# Altium schematic sheet BigButtons.SchDoc
size Letter; Organization: Ploopy Corporation; Address1: 137-1140 Burnhamthorpe Road W; Address3: Ontario; DocumentNumber: 2; Revision: R1.007; SheetNumber: 2; SheetTotal: 5
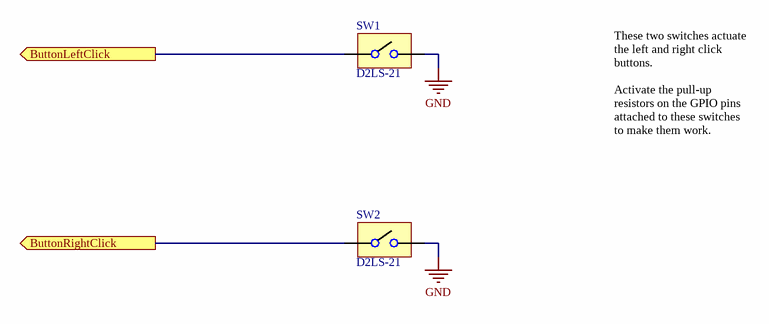
[diagram p0: BigButtons.SchDoc]

## Parts
SW1  D2LS-21  [D2LS-21]
SW2  D2LS-21  [D2LS-21]

## Ports
ButtonLeftClick (out), ButtonRightClick (out)

## Nets
GND: SW1.B SW2.B
ButtonLeftClick: SW1.A ; port ButtonLeftClick
ButtonRightClick: SW2.A ; port ButtonRightClick

## Notes on the sheet
- These two switches actuate the left and right click buttons.
  Activate the pull-up resistors on the GPIO pins attached to these switches to make them work.
- Copyright Ploopy Corporation 2024
- Licensed under the CERN-OHL-S v2
- http://ohwr.org/cernohl
- Title:
- PCB:
- Version:
- Ploopy Corporation
- Mississauga ON L5C 0A3
- 137-1140 Burnhamthorpe Road W
- Date:
- Time:
- Sheet
- of
- Canada

## Library data of the parts
SW1 SW2 = D2LS-21: Compact Surface-mounting Switch for long durability; Supplier 1: Digi-Key; Supplier 2: Mouser; Supplier Part Number 1: Z4378CT-ND; Supplier Part Number 2: 653-D2LS-21